# Altium project flowhw.PrjPcb
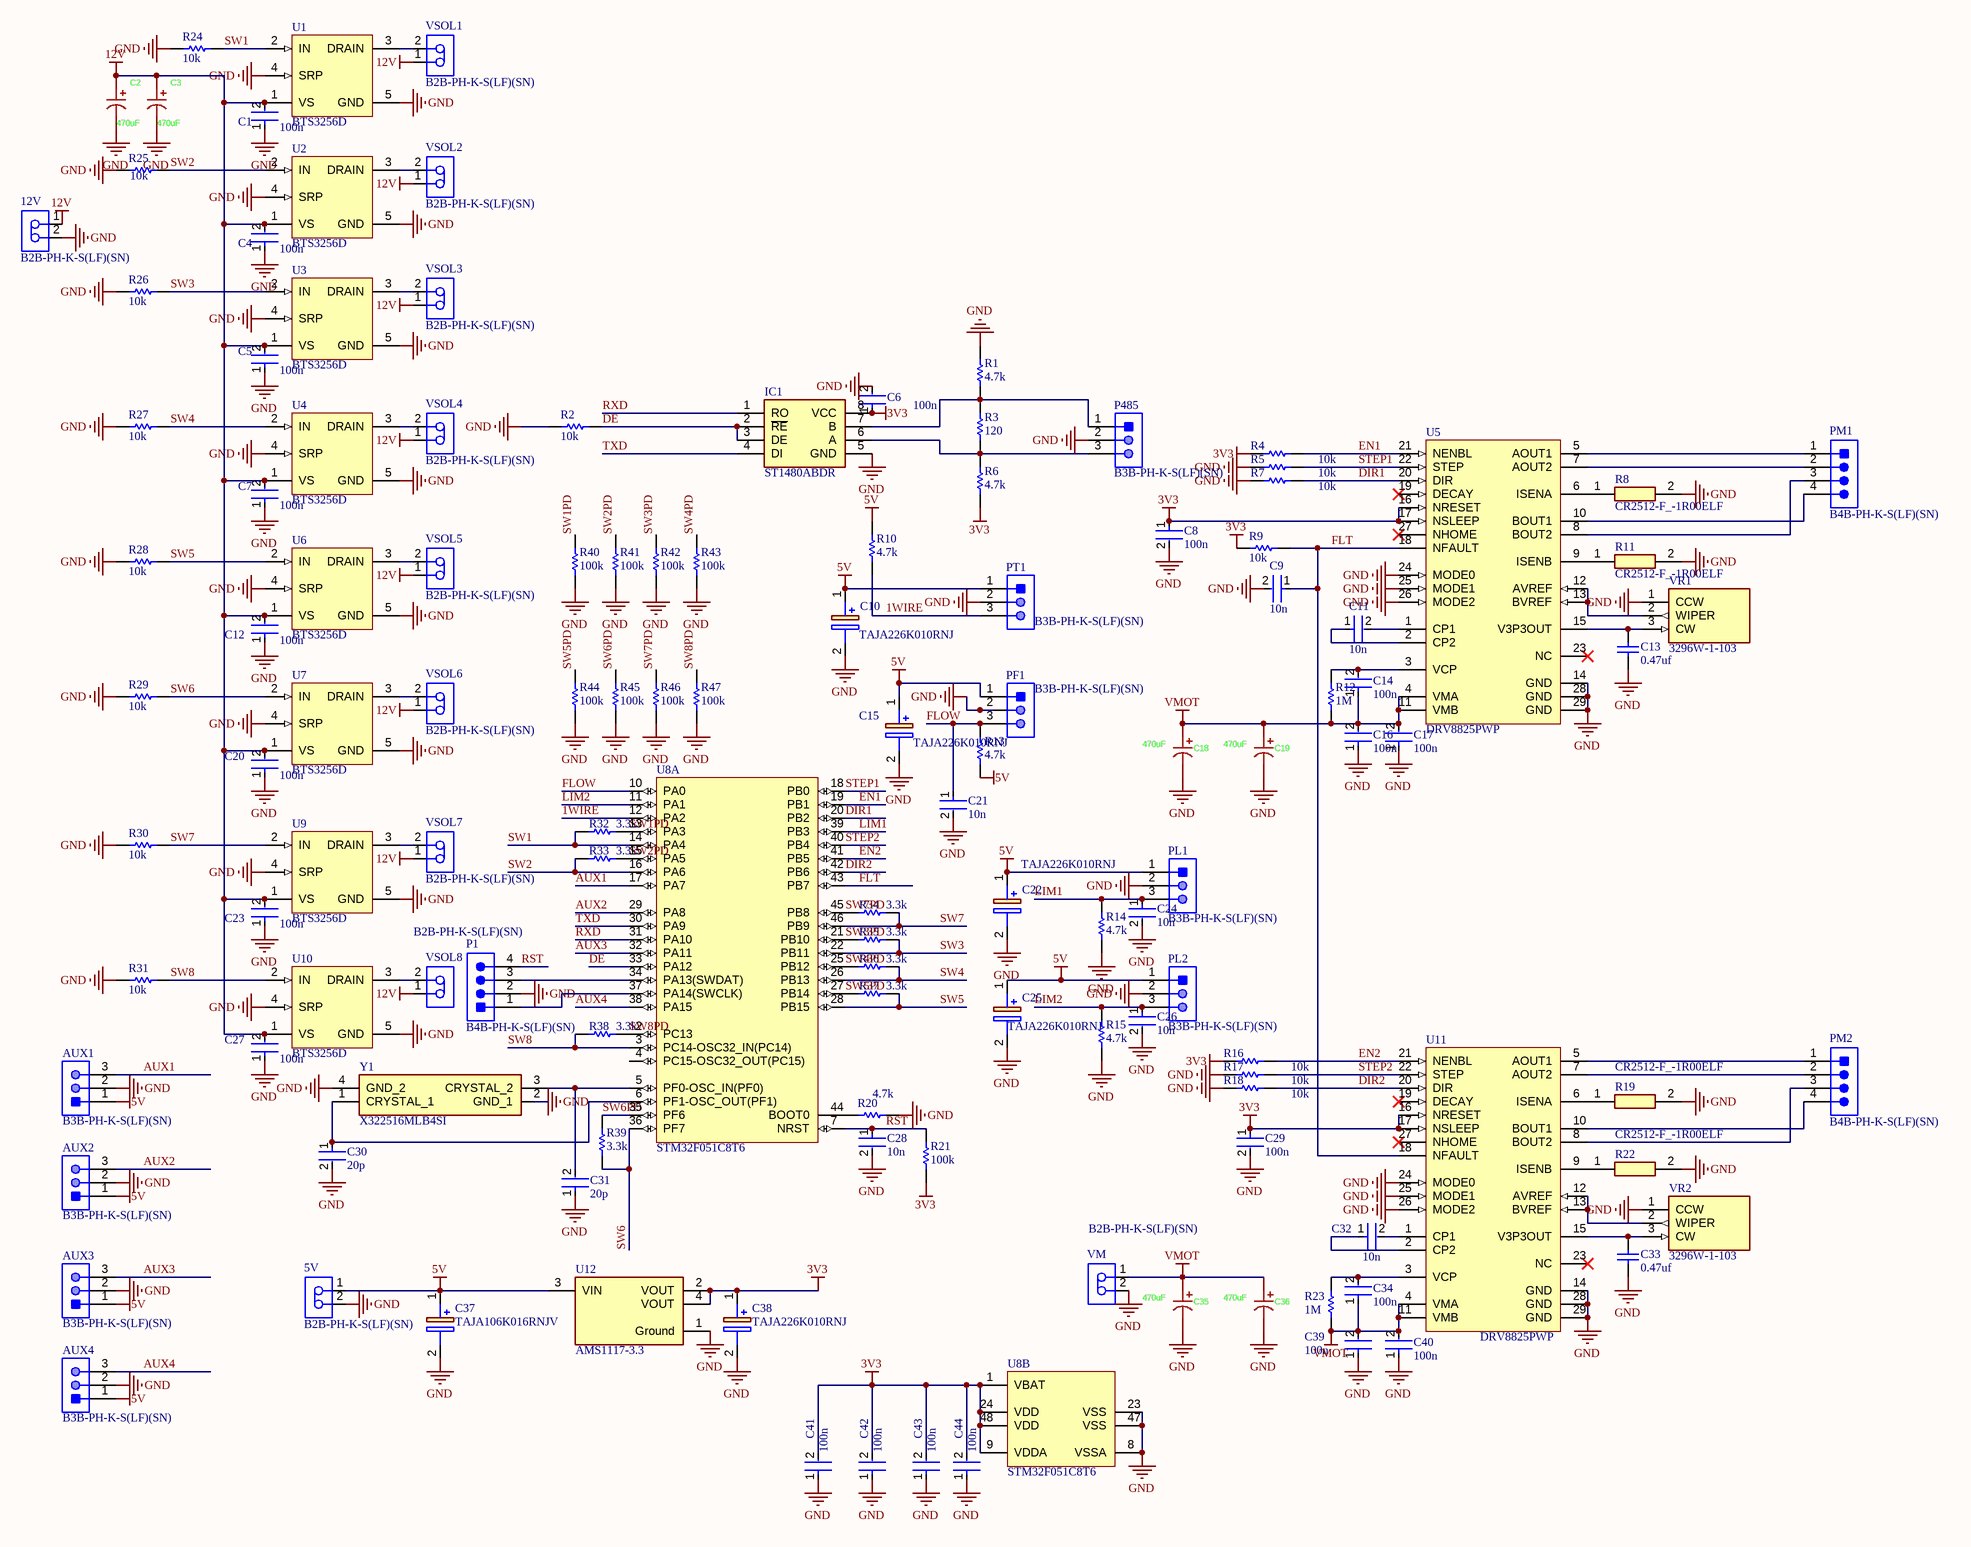
[diagram p0: flowhw.SchDoc]
1 sheet, 130 parts. Net scope: global (net labels, ports and power ports of the same name join across sheets).
Board file: flowhw.PcbDoc

## Sheet flowhw.SchDoc
size 594 x 420 mm; SheetNumber: 1; SheetTotal: 1

### Parts
5V  B2B-PH-K-S(LF)(SN)  [JST-B2B-PH-K-S_V]
12V  B2B-PH-K-S(LF)(SN)  [JST-B2B-PH-K-S_V]
AUX1  B3B-PH-K-S(LF)(SN)  [JST-B3B-PH-K-S-3_V]
AUX2  B3B-PH-K-S(LF)(SN)  [JST-B3B-PH-K-S-3_V]
AUX3  B3B-PH-K-S(LF)(SN)  [JST-B3B-PH-K-S-3_V]
AUX4  B3B-PH-K-S(LF)(SN)  [JST-B3B-PH-K-S-3_V]
C1  100n  [FP-C0402-BB-MFG]
C2  470uF  [470UF]
C3  470uF  [470UF]
C4  100n  [FP-C0402-BB-MFG]
C5  100n  [FP-C0402-BB-MFG]
C6  100n  [FP-C0402-BB-MFG]
C7  100n  [FP-C0402-BB-MFG]
C8  100n  [FP-C0402-BB-MFG]
C9  10n  [FP-C0402-BB-MFG]
C10  TAJA226K010RNJ  [CAPPM3216X180N]
C11  10n  [FP-C0402-BB-MFG]
C12  100n  [FP-C0402-BB-MFG]
C13  0.47uf  [CAPC1608X90X35LL15T15]
C14  100n  [FP-C0402-BB-MFG]
C15  TAJA226K010RNJ  [CAPPM3216X180N]
C16  100n  [FP-C0402-BB-MFG]
C17  100n  [FP-C0402-BB-MFG]
C18  470uF  [470UF]
C19  470uF  [470UF]
C20  100n  [FP-C0402-BB-MFG]
C21  10n  [FP-C0402-BB-MFG]
C22  TAJA226K010RNJ  [CAPPM3216X180N]
C23  100n  [FP-C0402-BB-MFG]
C24  10n  [FP-C0402-BB-MFG]
C25  TAJA226K010RNJ  [CAPPM3216X180N]
C26  10n  [FP-C0402-BB-MFG]
C27  100n  [FP-C0402-BB-MFG]
C28  10n  [FP-C0402-BB-MFG]
C29  100n  [FP-C0402-BB-MFG]
C30  20p  [FP-C0402-BB-MFG]
C31  20p  [FP-C0402-BB-MFG]
C32  10n  [FP-C0402-BB-MFG]
C33  0.47uf  [CAPC1608X90X35LL15T15]
C34  100n  [FP-C0402-BB-MFG]
C35  470uF  [470UF]
C36  470uF  [470UF]
C37  TAJA106K016RNJV  [CAPPM3216X180N]
C38  TAJA226K010RNJ  [CAPPM3216X180N]
C39  100n  [FP-C0402-BB-MFG]
C40  100n  [FP-C0402-BB-MFG]
C41  100n  [FP-C0402-BB-MFG]
C42  100n  [FP-C0402-BB-MFG]
C43  100n  [FP-C0402-BB-MFG]
C44  100n  [FP-C0402-BB-MFG]
IC1  ST1480ABDR  [SOIC127P600X175-8N]
P1  B4B-PH-K-S(LF)(SN)  [JST-B4B-PH-K-S_V]
P485  B3B-PH-K-S(LF)(SN)  [JST-B3B-PH-K-S-3_V]
PF1  B3B-PH-K-S(LF)(SN)  [JST-B3B-PH-K-S-3_V]
PL1  B3B-PH-K-S(LF)(SN)  [JST-B3B-PH-K-S-3_V]
PL2  B3B-PH-K-S(LF)(SN)  [JST-B3B-PH-K-S-3_V]
PM1  B4B-PH-K-S(LF)(SN)  [JST-B4B-PH-K-S_V]
PM2  B4B-PH-K-S(LF)(SN)  [JST-B4B-PH-K-S_V]
PT1  B3B-PH-K-S(LF)(SN)  [JST-B3B-PH-K-S-3_V]
R1  4.7k  [RESC1005X40X25LL05T10]
R2  10k  [RESC1005X40X25LL05T10]
R3  120  [RESC1005X40X25LL05T10]
R4  10k  [RESC1005X40X25LL05T10]
R5  10k  [RESC1005X40X25LL05T10]
R6  4.7k  [RESC1005X40X25LL05T10]
R7  10k  [RESC1005X40X25LL05T10]
R8  CR2512-F_-1R00ELF  [RESC6331X75N]
R9  10k  [RESC1005X40X25LL05T10]
R10  4.7k  [RESC1005X40X25LL05T10]
R11  CR2512-F_-1R00ELF  [RESC6331X75N]
R12  1M  [RESC1005X40X25LL05T10]
R13  4.7k  [RESC1005X40X25LL05T10]
R14  4.7k  [RESC1005X40X25LL05T10]
R15  4.7k  [RESC1005X40X25LL05T10]
R16  10k  [RESC1005X40X25LL05T10]
R17  10k  [RESC1005X40X25LL05T10]
R18  10k  [RESC1005X40X25LL05T10]
R19  CR2512-F_-1R00ELF  [RESC6331X75N]
R20  4.7k  [RESC1005X40X25LL05T10]
R21  100k  [RESC1005X40X25LL05T10]
R22  CR2512-F_-1R00ELF  [RESC6331X75N]
R23  1M  [RESC1005X40X25LL05T10]
R24  10k  [RESC1005X40X25LL05T10]
R25  10k  [RESC1005X40X25LL05T10]
R26  10k  [RESC1005X40X25LL05T10]
R27  10k  [RESC1005X40X25LL05T10]
R28  10k  [RESC1005X40X25LL05T10]
R29  10k  [RESC1005X40X25LL05T10]
R30  10k  [RESC1005X40X25LL05T10]
R31  10k  [RESC1005X40X25LL05T10]
R32  3.3k  [RESC1005X40X25LL05T10]
R33  3.3k  [RESC1005X40X25LL05T10]
R34  3.3k  [RESC1005X40X25LL05T10]
R35  3.3k  [RESC1005X40X25LL05T10]
R36  3.3k  [RESC1005X40X25LL05T10]
R37  3.3k  [RESC1005X40X25LL05T10]
R38  3.3k  [RESC1005X40X25LL05T10]
R39  3.3k  [RESC1005X40X25LL05T10]
R40  100k  [RESC1005X40X25LL05T10]
R41  100k  [RESC1005X40X25LL05T10]
R42  100k  [RESC1005X40X25LL05T10]
R43  100k  [RESC1005X40X25LL05T10]
R44  100k  [RESC1005X40X25LL05T10]
R45  100k  [RESC1005X40X25LL05T10]
R46  100k  [RESC1005X40X25LL05T10]
R47  100k  [RESC1005X40X25LL05T10]
U1  BTS3256D  [INF-PG-TO252-5-1_M]
U2  BTS3256D  [INF-PG-TO252-5-1_M]
U3  BTS3256D  [INF-PG-TO252-5-1_M]
U4  BTS3256D  [INF-PG-TO252-5-1_M]
U5  DRV8825PWP  [PWP0028C_L]
U6  BTS3256D  [INF-PG-TO252-5-1_M]
U7  BTS3256D  [INF-PG-TO252-5-1_M]
U8  STM32F051C8T6  [STM-LQFP48_N]  (parts A,B of 2)
U9  BTS3256D  [INF-PG-TO252-5-1_M]
U10  BTS3256D  [INF-PG-TO252-5-1_M]
U11  DRV8825PWP  [PWP0028C_L]
U12  AMS1117-3.3  [FP-AMS1117-IPC_C]
VM  B2B-PH-K-S(LF)(SN)  [JST-B2B-PH-K-S_V]
VR1  3296W-1-103  [3296W1103]
VR2  3296W-1-103  [3296W1103]
VSOL1  B2B-PH-K-S(LF)(SN)  [JST-B2B-PH-K-S_V]
VSOL2  B2B-PH-K-S(LF)(SN)  [JST-B2B-PH-K-S_V]
VSOL3  B2B-PH-K-S(LF)(SN)  [JST-B2B-PH-K-S_V]
VSOL4  B2B-PH-K-S(LF)(SN)  [JST-B2B-PH-K-S_V]
VSOL5  B2B-PH-K-S(LF)(SN)  [JST-B2B-PH-K-S_V]
VSOL6  B2B-PH-K-S(LF)(SN)  [JST-B2B-PH-K-S_V]
VSOL7  B2B-PH-K-S(LF)(SN)  [JST-B2B-PH-K-S_V]
VSOL8  B2B-PH-K-S(LF)(SN)  [JST-B2B-PH-K-S_V]
Y1  X322516MLB4SI  [X322516MLB4SI]

### Nets
3V3: C6.1 C8.1 C29.1 C38.1(+) C41.2 C42.2 C43.2 C44.2 IC1.8(VCC) R4.1 R6.2 R9.1 R16.1 R21.2 U5.16(NRESET) U5.17(NSLEEP) U8.1(VBAT) U8.9(VDDA) U8.24(VDD) U8.48(VDD) U11.16(NRESET) U11.17(NSLEEP) U12.2(VOUT) U12.4(VOUT)
5V: 5V.1 AUX1.1 AUX2.1 AUX3.1 AUX4.1 C10.1(+) C15.1(+) C22.1(+) C25.1(+) C37.1(+) PF1.1 PL1.1 PL2.1 PT1.1 R10.1 R13.2 U12.3(VIN)
12V: 12V.1 C1.2 C2.1 C3.1 C4.2 C5.2 C7.2 C12.2 C20.2 C23.2 C27.2 U1.1(VS) U2.1(VS) U3.1(VS) U4.1(VS) U6.1(VS) U7.1(VS) U9.1(VS) U10.1(VS) VSOL1.1 VSOL2.1 VSOL3.1 VSOL4.1 VSOL5.1 VSOL6.1 VSOL7.1 VSOL8.1
GND: 5V.2 12V.2 AUX1.2 AUX2.2 AUX3.2 AUX4.2 C1.1 C2.2 C3.2 C4.1 C5.1 C6.2 C7.1 C8.2 C9.2 C10.2(-) C12.1 C13.1 C15.2(-) C16.1 C17.1 C18.2 C19.2 C20.1 C21.2 C22.2(-) C23.1 C24.2 C25.2(-) C26.2 C27.1 C28.2 C29.2 C30.2 C31.1 C33.1 C35.2 C36.2 C37.2(-) C38.2(-) C39.1 C40.1 C41.1 C42.1 C43.1 C44.1 IC1.5(GND) P1.2 P485.2 PF1.2 PL1.2 PL2.2 PT1.2 R1.1 R2.2 R5.1 R7.1 R8.2 R11.2 R14.2 R15.2 R17.1 R18.1 R19.2 R20.2 R22.2 R24.2 R25.2 R26.2 R27.2 R28.2 R29.2 R30.2 R31.2 R40.2 R41.2 R42.2 R43.2 R44.2 R45.2 R46.2 R47.2 U1.4(SRP) U1.5(GND) U2.4(SRP) U2.5(GND) U3.4(SRP) U3.5(GND) U4.4(SRP) U4.5(GND) U5.14(GND) U5.24(MODE0) U5.25(MODE1) U5.26(MODE2) U5.28(GND) U5.29(GND) U6.4(SRP) U6.5(GND) U7.4(SRP) U7.5(GND) U8.8(VSSA) U8.23(VSS) U8.47(VSS) U9.4(SRP) U9.5(GND) U10.4(SRP) U10.5(GND) U11.14(GND) U11.24(MODE0) U11.25(MODE1) U11.26(MODE2) U11.28(GND) U11.29(GND) U12.1(Ground) VM.2 VR1.1(CCW) VR2.1(CCW) Y1.2(GND_1) Y1.4(GND_2)
VMOT: C14.1 C16.2 C17.2 C18.1 C19.1 C34.1 C35.1 C36.1 C39.2 C40.2 R12.1 R23.1 U5.4(VMA) U5.11(VMB) U11.4(VMA) U11.11(VMB) VM.1
1WIRE: PT1.3 R10.2 U8.12(PA2)
AUX1: AUX1.3 U8.17(PA7)
AUX2: AUX2.3 U8.29(PA8)
AUX3: AUX3.3 U8.32(PA11)
AUX4: AUX4.3 U8.38(PA15)
DE: IC1.2(~{RE}) IC1.3(DE) R2.1 U8.33(PA12)
DIR1: R7.2 U5.20(DIR) U8.20(PB2)
DIR2: R18.2 U8.42(PB6) U11.20(DIR)
EN1: R4.2 U5.21(NENBL) U8.19(PB1)
EN2: R16.2 U8.41(PB5) U11.21(NENBL)
FLOW: C21.1 PF1.3 R13.1 U8.10(PA0)
FLT: C9.1 R9.2 U5.18(NFAULT) U8.43(PB7) U11.18(NFAULT)
LIM1: C24.1 PL1.3 R14.1 U8.39(PB3)
LIM2: C26.1 PL2.3 R15.1 U8.11(PA1)
RST: C28.1 P1.4 R21.1 U8.7(NRST)
RXD: IC1.1(RO) U8.31(PA10)
STEP1: R5.2 U5.22(STEP) U8.18(PB0)
STEP2: R17.2 U8.40(PB4) U11.22(STEP)
SW1: R24.1 R32.2 U1.2(IN) U8.14(PA4)
SW1PD: R32.1 R40.1 U8.13(PA3)
SW2: R25.1 R33.2 U2.2(IN) U8.16(PA6)
SW2PD: R33.1 R41.1 U8.15(PA5)
SW3: R26.1 R35.1 U3.2(IN) U8.22(PB11)
SW3PD: R35.2 R42.1 U8.21(PB10)
SW4: R27.1 R36.1 U4.2(IN) U8.26(PB13)
SW4PD: R36.2 R43.1 U8.25(PB12)
SW5: R28.1 R37.1 U6.2(IN) U8.28(PB15)
SW5PD: R37.2 R44.1 U8.27(PB14)
SW6: R29.1 R39.2 U7.2(IN) U8.36(PF7)
SW6PD: R39.1 R45.1 U8.35(PF6)
SW7: R30.1 R34.1 U8.46(PB9) U9.2(IN)
SW7PD: R34.2 R46.1 U8.45(PB8)
SW8: R31.1 R38.2 U8.3(PC14-OSC32_IN(PC14)) U10.2(IN)
SW8PD: R38.1 R47.1 U8.2(PC13)
TXD: IC1.4(DI) U8.30(PA9)
NetC11_1: C11.1 U5.2(CP2)
NetC11_2: C11.2 U5.1(CP1)
NetC13_2: C13.2 U5.15(V3P3OUT) VR1.3(CW)
NetC14_2: C14.2 R12.2 U5.3(VCP)
NetC30_1: C30.1 U8.6(PF1-OSC_OUT(PF1)) Y1.1(CRYSTAL_1)
NetC31_2: C31.2 U8.5(PF0-OSC_IN(PF0)) Y1.3(CRYSTAL_2)
NetC32_1: C32.1 U11.2(CP2)
NetC32_2: C32.2 U11.1(CP1)
NetC33_2: C33.2 U11.15(V3P3OUT) VR2.3(CW)
NetC34_2: C34.2 R23.2 U11.3(VCP)
NetIC1_6: IC1.6(A) P485.3 R3.2 R6.1
NetIC1_7: IC1.7(B) P485.1 R1.2 R3.1
NetP1_1: P1.1 U8.37(PA14(SWCLK))
NetP1_3: P1.3 U8.34(PA13(SWDAT))
NetPM1_1: PM1.1 U5.5(AOUT1)
NetPM1_2: PM1.2 U5.7(AOUT2)
NetPM1_3: PM1.3 U5.8(BOUT2)
NetPM1_4: PM1.4 U5.10(BOUT1)
NetPM2_1: PM2.1 U11.5(AOUT1)
NetPM2_2: PM2.2 U11.7(AOUT2)
NetPM2_3: PM2.3 U11.8(BOUT2)
NetPM2_4: PM2.4 U11.10(BOUT1)
NetR8_1: R8.1 U5.6(ISENA)
NetR11_1: R11.1 U5.9(ISENB)
NetR19_1: R19.1 U11.6(ISENA)
NetR20_1: R20.1 U8.44(BOOT0)
NetR22_1: R22.1 U11.9(ISENB)
NetU1_3: U1.3(DRAIN) VSOL1.2
NetU2_3: U2.3(DRAIN) VSOL2.2
NetU3_3: U3.3(DRAIN) VSOL3.2
NetU4_3: U4.3(DRAIN) VSOL4.2
NetU5_12: U5.12(AVREF) U5.13(BVREF) VR1.2(WIPER)
NetU6_3: U6.3(DRAIN) VSOL5.2
NetU7_3: U7.3(DRAIN) VSOL6.2
NetU9_3: U9.3(DRAIN) VSOL7.2
NetU10_3: U10.3(DRAIN) VSOL8.2
NetU11_12: U11.12(AVREF) U11.13(BVREF) VR2.2(WIPER)

Not connected (* = marked no-connect by the designer): U5 19(DECAY)* 23(NC)* 27(NHOME)*; U8 4(PC15-OSC32_OUT(PC15)); U11 19(DECAY)* 23(NC)* 27(NHOME)*

### Notes on the sheet
- DWG NO:
- REV:
- THIS DOCUMENT AND THE DATA DISCLOSED HEREIN OR
- HEREWITH IS THE PROPERTY OF ALTIUM LIMITED AND MAY
- BE FREELY DISTRIBUTED IN WHOLE. NO RIGHTS ARE
- RESERVED OR EXPRESS OR IMPLIED WARANTEE GIVEN.
- REVISION
- DESCRIPTION
- DATE
- APPROVED
- ENG:
- APPROVALS
- PROJECT
- DSN:
- CHK:
- REFERENCE DOCUMENTS
- PROJECT REVISION:
- TITLE
- DOCUMENT REVISION:
- DESIGN ITEM:
- BOM:
- FAB DWG:
- PCB DWG:
- ASSY DWG:
- SCALE:
- A2
- SIZE
- CAGE CODE
- FILE NAME
- DWG NO.
- SHEET
- OF
- REV

### Library data of the parts
5V 12V VM VSOL1-VSOL8 = CMP-2000-05162-1: Male Header, Pitch 2 mm, 1 x 2 Position, Height 6 mm, Tail Length 3.4 mm, -25 to 85 degC, RoHS, Bulk; Manufacturer: JST; Pitch: 2mm; Style/Orientation: StraightHeader/Plug; No of Positions: 2; Datasheet Version: Nov-08; Datasheet URL: http://datasheet.octopart.com/B2B-PH-K-S%28LF%29%28SN%29-JST-datasheet-8324864.pdf; Manufacturer URL: http://www.jst.com/home2.html; Type: ShroudedHeader; Termination: Crimp
AUX1-AUX4 P485 PF1 PL1 PL2 PT1 = CMP-2000-05164-1: Male Header, Pitch 2 mm, 1 x 3 Position, Height 6 mm, Tail Length 3.4 mm, -25 to 85 degC, RoHS, Bulk; Manufacturer: JST; Style/Orientation: StraightHeader/Plug; Pitch: 2mm; No of Positions: 3; Termination: Crimp; Manufacturer URL: http://www.jst.com/home2.html; Datasheet Version: Oct-06; Type: ShroudedHeader; Datasheet URL: https://datasheet.ciiva.com/11746/0900766b80826550-11746939.pdf
C1 C4-C9 C11 C12 C14 C16 C17 C20 C21 C23 C24 C26-C32 C34 C39-C44 = CMP-03020-024178-1: C0402 8.2 pF C0G 0.5 pF 50 V; Manufacturer Part Number: C0402C829D5GACAUTO; Manufacturer: Kemet; Temperature Coefficient: 15%; Voltage Rating: 50 V; Tolerance: 0.5 pF; Value: 8.2 pF; Material: Ceramic; Device Class L3: Ceramic Capacitors; RoHS: TRUE; Device Class L1: Passive Components; Ipc Land Pattern Name: CAPC10050X50; Temperature Characteristic: C0G; ComponentLink2URL: https://content.kemet.com/datasheets/KEM_C1002_X7R_SMD.pdf; Automotive: No; Package: C0402-BB; Temperature Range Low: -55°C; Octopart: https://octopart.com/c0402c829d5gacauto-kemet-89441553; Device Class L2: Capacitors; ComponentLink2Description: Datasheet; Lead Free: Yes; Capacitance: 8.2 pF; Temperature: -55°C to +125°C; Temperature Range High: +125°C; Category: Cap; Height: 0.55mm
C2 C3 C18 C19 C35 C36 = SPZ1VM471G13O00RAXXX: Manufacturer: AISHI(艾华集团); Add into BOM: yes; Tolerance: ±20%; Voltage Rating: 35V; Type: Polymer; Lifetime: 2000hrs@105℃; Symbol: SPZ1VM471G13O00RAXXX; Device: SPZ1VM471G13O00RAXXX; LCSC Part Name: 470uF ±20% 35V; Supplier Part: C2691847; Manufacturer Part: SPZ1VM471G13O00RAXXX; Supplier Footprint: 插件,D10xL13mm; JLCPCB Part Class: Extended Part; Datasheet: https://item.szlcsc.com/datasheet/SPZ1VM471G13O00RAXXX/2802119.html; Supplier: LCSC; Convert to PCB: yes; Value: 470uF; Ripple Current: -; Equivalent Series Resistance(ESR): -; Pin Spacing: -; Diameter: 10mm; Height - Seated (Max): 13mm; Operating Temperature: -55℃~+105℃
C10 C15 C22 C25 C38 = TAJA226K010RNJ: Capacitor Polarised; Manufacturer_Name: Kyocera AVX; Datasheet Link: http://www.farnell.com/datasheets/1680476.pdf; Height: 1.8mm; Manufacturer_Part_Number: TAJA226K010RNJ; Mouser Part Number: 581-TAJA226K010R; Mouser Price/Stock: https://www.mouser.co.uk/ProductDetail/KYOCERA-AVX/TAJA226K010RNJ?qs=ZfDiupplM3QM%252BN91%252BvwCuQ%3D%3D; Arrow Part Number: TAJA226K010RNJ; Arrow Price/Stock: https://www.arrow.com/en/products/taja226k010rnj/avx?region=nac
C13 C33 = CMP-2006-02133-1: Manufacturer: AVX Interconnect / Elco; Part Number: 0603ZC101KAT2A
C37 = TAJA106K016RNJV: Capacitor Polarised; Manufacturer_Name: Kyocera AVX; Datasheet Link: http://www.farnell.com/datasheets/1680476.pdf; Height: 1.8mm; Manufacturer_Part_Number: TAJA106K016RNJV; Mouser Part Number: 581-TAJA106K016RNJV; Mouser Price/Stock: https://www.mouser.co.uk/ProductDetail/KYOCERA-AVX/TAJA106K016RNJV?qs=X421pCAdHWe2u1fVMeO6XQ%3D%3D; Arrow Part Number: TAJA106K016RNJV; Arrow Price/Stock: https://www.arrow.com/en/products/taja106k016rnjv/avx?utm_currency=USD&region=nac
IC1 = ST1480ABDR: Integrated Circuit; Manufacturer_Name: STMicroelectronics; Datasheet Link: https://www.st.com/resource/en/datasheet/st1480ab.pdf; Height: 1.75mm; Manufacturer_Part_Number: ST1480ABDR; Mouser Part Number: 511-ST1480ABDR; Mouser Price/Stock: https://www.mouser.co.uk/ProductDetail/STMicroelectronics/ST1480ABDR?qs=U1cgCdF9Le885kMYiMY8iw%3D%3D; Arrow Part Number: ST1480ABDR; Arrow Price/Stock: https://www.arrow.com/en/products/st1480abdr/stmicroelectronics?region=nac
P1 PM1 PM2 = CMP-2000-05165-1: Male Header, Pitch 2 mm, 1 x 4 Position, Height 6 mm, Tail Length 3.4 mm, -25 to 85 degC, RoHS, Bulk; Manufacturer: JST; No of Positions: 4; Style/Orientation: StraightHeader/Plug; Pitch: 2mm; Datasheet URL: http://datasheet.octopart.com/B4B-PH-K-S%28LF%29%28SN%29-JST-datasheet-10558886.pdf; Type: ShroudedHeader; Manufacturer URL: http://www.jst.com/home2.html; Termination: Crimp; Datasheet Version: Apr-09
R1-R7 R9 R10 R12-R18 R20 R21 R23-R47 = CMP-2002-07161-1: Part Number: RC0402FR-0720R5L; Manufacturer: Yageo / Phycomp
R8 R11 R19 R22 = CR2512-F_-1R00ELF: Resistor; Manufacturer_Name: Bourns; Manufacturer_Part_Number: CR2512-F/-1R00ELF; Height: 0.75mm; Mouser Part Number: 652-CR2512-F/1R00ELF; Mouser Price/Stock: https://www.mouser.co.uk/ProductDetail/Bourns/CR2512-F-1R00ELF?qs=W%2FMpXkg%252BdQ6b1PcPiGLK9Q%3D%3D; Arrow Part Number: CR2512-F/-1R00ELF; Arrow Price/Stock: https://www.arrow.com/en/products/cr2512-f-1r00elf/bourns?utm_currency=USD&region=europe
U1-U4 U6 U7 U9 U10 = CMP-1137-00035-1: HITFET 10 mOhm Smart Power Single Channel Low Side Switch with Restart and Variable Slew Rate, 40 V VDS, ID, -40 to 150 degC, PG-TO252-5-1, Reel, Green; Manufacturer: Infineon; ID(nom): 7.5 A; ISC (max): 30 A; ID(lim) (min): 42 A; Green: TRUE; Channels: 1; RDS (on)(max): 10 mOhm; VDS (max): 40 V; toff (max): 24 us; ton (max): 22 us; ComponentLink1Description: Manufacturer URL; PackageDescription: 5-Pin Plastic (Green) Transistor Single Outline Package, 6.5 x 6.12 mm Body, 1.14 mm Pitch; ComponentLink3URL: http://www.infineon.com/cms/packages/SMD_-_Surface_Mounted_Devices/P-PG-TO252/P-PG-TO252-05-001.html?__locale=en; ComponentLink2URL: http://www.infineon.com/dgdl/BTS3256_DS_10.pdf?folderId=db3a3043163797a6011667aa084c0e01&fileId=db3a304320d39d590121a175cad77b78&location=en.Products.Automotive_ICs.Smart_High-_and_Low-Side_Switches.HITFET___TEMPFET__-_Smart_Low-Side_Switches.DATASHEET.BTS; Packing: Reel; PartNumber: BTS3256D; DatasheetVersion: Rev. 1.0; ComponentLink1URL: http://www.infineon.com/; ComponentLink3Description: Package Specification; Halogen-free: TRUE; Group: HITFET; PackageReference: PG-TO252-5-1; Mounting Technology: Surface Mount; ComponentLink2Description: Datasheet
U5 U11 = CMP-1685-00019-1: Stepper Motor Controller IC, 8.2 to 45 V, -40 to 85 degC, 28-Pin HTSSOP (PWP), Green (RoHS & no Sb/Br), Tube; Voltage Rating: 100 V; Tolerance: 20%; Capacitance: 47 uF; Case\Package: Radial; ComponentLink2URL: http://www.ti.com/general/docs/lit/getliterature.tsp?genericPartNumber=DRV8825&fileType=pdf; Voltage Rating (DC): 100 V; Lead Pitch: 3.5 mm; Diameter: 8 mm; DatasheetVersion: SLVSA73F, 07/2014; ComponentLink2Description: Datasheet; Package Quantity: 200; PackageDescription: 28-Pin Small Outline Package Integrated Circuit, Body 9.7 x 4.4 mm, Pitch 0.65 mm; Packaging: Bulk; Pins: 2; Min Operating Temperature: -40 degC; Width: 8 mm; ComponentLink1Description: Manufacturer URL; Length: 11.5 mm; Max Operating Temperature: 85 degC; Height: 11.5 mm; REACH SVHC: No SVHC; Mount: Through Hole; PackageReference: PWP0028C; RoHSCompliant: true; Radiation Hardening: No; ComponentLink1URL: http://www.ti.com/
U8 = CMP-0304-00010-3: ARM Cortex-M0 32-bit MCU, 64 KB Flash, 8 KB Internal RAM, 39 I/Os, 48-pin LQFP, -40 to 85 degC, Tray; Internal RAM Size (kB): 8; I/Os (High Current): 39; Supply Voltage(Vcc) min (V): 2; FLASH Size (Prog) (kB): 64; Operating Frequency(F) (Processor speed) (MHz): 48; Packing: Tray; Core: ARM Cortex-M0; PartNumber: STM32F051C8T6; DatasheetVersion: Rev. 3; PackageVersion: Rev. 6, 06/2013; PackageReference: LQFP48; PackageDescription: 48-Pin Low Profile Quad Flat Package, 7 x 7 mm Body, 0.5 mm Pitch; Mounting Technology: Surface Mount; ComponentLink1Description: Manufacturer URL; ComponentLink3URL: http://www.st.com/st-web-ui/static/active/en/resource/technical/document/datasheet/DM00058181.pdf; ComponentLink1URL: http://www.st.com/web/en/home.html; ComponentLink2Description: Datasheet; ComponentLink3Description: Package Specification; ComponentLink2URL: http://www.st.com/st-web-ui/static/active/en/resource/technical/document/datasheet/DM00039193.pdf
U12 = CMP-209535-000001-1: LDO Voltage Regulators 1A, 3.3V; Manufacturer: Advanced Monolithic Systems; Dropout Voltage: 1.1V; Output Type: Fixed; Nominal Supply Current: 5mA; Max Power Dissipation: 1.2W; Max Supply Voltage: 15V; Number Of Outputs: 1; Standoff Height: 0.64mm; Max Junction Temp: +125°C; Height: 1.8mm; Package: AMS1117; Device Class L2: Power Management ICs; ComponentLink2Description: Datasheet; ComponentLink2URL: http://www.advanced-monolithic.com/pdf/ds1117.pdf; Category: IC; RoHS: TRUE; Automotive: No; Device Class L1: Integrated Circuits (ICs); Output Current: 1A; Device Class L3: Voltage Regulators - Linear; Temperature: -40°C to +125°C; Output Voltage: 3.3V; Manufacturer Part Number: AMS1117-3.3; Temperature Range Low: -40°C; Octopart: https://octopart.com/ams1117-3.3-advanced+monolithic+systems-25899300; Lead Free: Yes; Ipc Land Pattern Name: SOT229P700X180-4; Temperature Range High: +125°C
VR1 VR2 = 3296W-1-103: Variable Resistor; Manufacturer_Name: Chengdu Guosheng Tech; Datasheet Link: https://datasheet.lcsc.com/szlcsc/1811271436_Chengdu-Guosheng-Tech-3296W-1-103_C330432.pdf; Height: 10.28mm; Manufacturer_Part_Number: 3296W-1-103
Y1 = X322516MLB4SI: Crystal or Oscillator; Manufacturer_Name: Yangxing Tech; Datasheet Link: https://datasheet.lcsc.com/szlcsc/Yangxing-Tech-X322516MLB4SI_C13738.pdf; Height: 0.8mm; Manufacturer_Part_Number: X322516MLB4SI